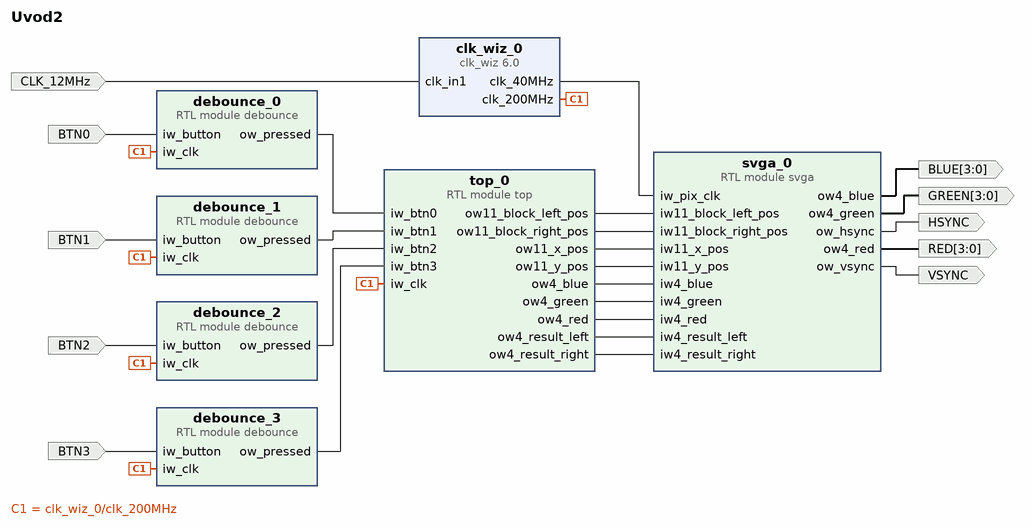
[diagram p0: block diagram of the top level]
# Vivado block design Uvod2, xc7s25csga324-1, Vivado 2025.1
create_bd_design Uvod2

create_bd_port -dir I -type clk CLK_12MHz
set_property -dict {CONFIG.FREQ_HZ 12000000} [get_bd_ports CLK_12MHz]
create_bd_port -dir I BTN0
create_bd_port -dir I BTN1
create_bd_port -dir I BTN2
create_bd_port -dir I BTN3
create_bd_port -dir O -from 3 -to 0 RED
create_bd_port -dir O -from 3 -to 0 GREEN
create_bd_port -dir O -from 3 -to 0 BLUE
create_bd_port -dir O HSYNC
create_bd_port -dir O VSYNC

create_bd_cell -type ip -vlnv xilinx.com:ip:clk_wiz:6.0 clk_wiz_0
set_property -dict [list \
  CONFIG.CLKIN1_JITTER_PS 833.33 \
  CONFIG.CLKOUT1_JITTER 522.440 \
  CONFIG.CLKOUT1_PHASE_ERROR 613.025 \
  CONFIG.CLKOUT1_REQUESTED_OUT_FREQ 200.000 \
  CONFIG.CLKOUT2_JITTER 686.725 \
  CONFIG.CLKOUT2_PHASE_ERROR 613.025 \
  CONFIG.CLKOUT2_REQUESTED_OUT_FREQ 40.000 \
  CONFIG.CLKOUT2_USED true \
  CONFIG.CLK_OUT1_PORT clk_200MHz \
  CONFIG.CLK_OUT2_PORT clk_40MHz \
  CONFIG.MMCM_CLKFBOUT_MULT_F 50.000 \
  CONFIG.MMCM_CLKIN1_PERIOD 83.333 \
  CONFIG.MMCM_CLKIN2_PERIOD 10.0 \
  CONFIG.MMCM_CLKOUT0_DIVIDE_F 3.000 \
  CONFIG.MMCM_CLKOUT1_DIVIDE 15 \
  CONFIG.NUM_OUT_CLKS 2 \
  CONFIG.PRIM_IN_FREQ 12.000 \
  CONFIG.USE_LOCKED false \
  CONFIG.USE_RESET false \
] [get_bd_cells clk_wiz_0]
create_bd_cell -type module -reference debounce debounce_0
create_bd_cell -type module -reference debounce debounce_1
create_bd_cell -type module -reference debounce debounce_2
create_bd_cell -type module -reference debounce debounce_3
create_bd_cell -type module -reference svga svga_0
create_bd_cell -type module -reference top top_0

# ---- connections ----

connect_bd_net [get_bd_ports CLK_12MHz] [get_bd_pins clk_wiz_0/clk_in1]
connect_bd_net [get_bd_pins clk_wiz_0/clk_200MHz] \
  [get_bd_pins debounce_0/iw_clk] [get_bd_pins debounce_1/iw_clk] [get_bd_pins debounce_2/iw_clk] \
  [get_bd_pins debounce_3/iw_clk] [get_bd_pins top_0/iw_clk]
connect_bd_net [get_bd_pins clk_wiz_0/clk_40MHz] [get_bd_pins svga_0/iw_pix_clk]
connect_bd_net [get_bd_pins debounce_0/ow_pressed] [get_bd_pins top_0/iw_btn0]
connect_bd_net [get_bd_pins debounce_1/ow_pressed] [get_bd_pins top_0/iw_btn1]
connect_bd_net [get_bd_pins debounce_2/ow_pressed] [get_bd_pins top_0/iw_btn2]
connect_bd_net [get_bd_pins debounce_3/ow_pressed] [get_bd_pins top_0/iw_btn3]
connect_bd_net -net iw_button_0_1 [get_bd_ports BTN0] [get_bd_pins debounce_0/iw_button]
connect_bd_net -net iw_button_1_1 [get_bd_ports BTN1] [get_bd_pins debounce_1/iw_button]
connect_bd_net -net iw_button_2_1 [get_bd_ports BTN2] [get_bd_pins debounce_2/iw_button]
connect_bd_net -net iw_button_3_1 [get_bd_ports BTN3] [get_bd_pins debounce_3/iw_button]
connect_bd_net [get_bd_pins svga_0/ow4_blue] [get_bd_ports BLUE]
connect_bd_net [get_bd_pins svga_0/ow4_green] [get_bd_ports GREEN]
connect_bd_net [get_bd_pins svga_0/ow4_red] [get_bd_ports RED]
connect_bd_net [get_bd_pins svga_0/ow_hsync] [get_bd_ports HSYNC]
connect_bd_net [get_bd_pins svga_0/ow_vsync] [get_bd_ports VSYNC]
connect_bd_net [get_bd_pins top_0/ow11_block_left_pos] [get_bd_pins svga_0/iw11_block_left_pos]
connect_bd_net [get_bd_pins top_0/ow11_block_right_pos] [get_bd_pins svga_0/iw11_block_right_pos]
connect_bd_net [get_bd_pins top_0/ow11_x_pos] [get_bd_pins svga_0/iw11_x_pos]
connect_bd_net [get_bd_pins top_0/ow11_y_pos] [get_bd_pins svga_0/iw11_y_pos]
connect_bd_net [get_bd_pins top_0/ow4_blue] [get_bd_pins svga_0/iw4_blue]
connect_bd_net [get_bd_pins top_0/ow4_green] [get_bd_pins svga_0/iw4_green]
connect_bd_net [get_bd_pins top_0/ow4_red] [get_bd_pins svga_0/iw4_red]
connect_bd_net [get_bd_pins top_0/ow4_result_left] [get_bd_pins svga_0/iw4_result_left]
connect_bd_net [get_bd_pins top_0/ow4_result_right] [get_bd_pins svga_0/iw4_result_right]

validate_bd_design
save_bd_design
